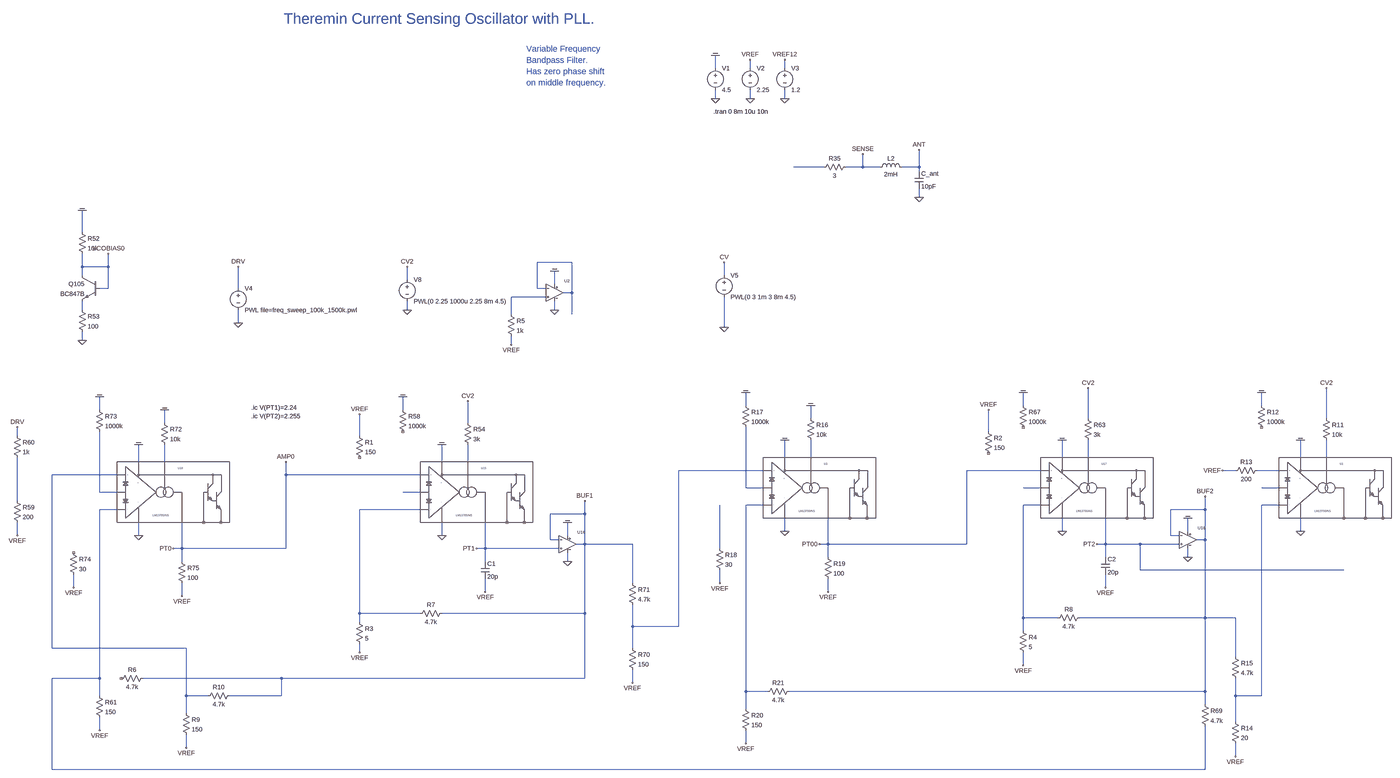
[diagram p0: schematic vco_and_lc_drive_v18.asc, whole sheet]
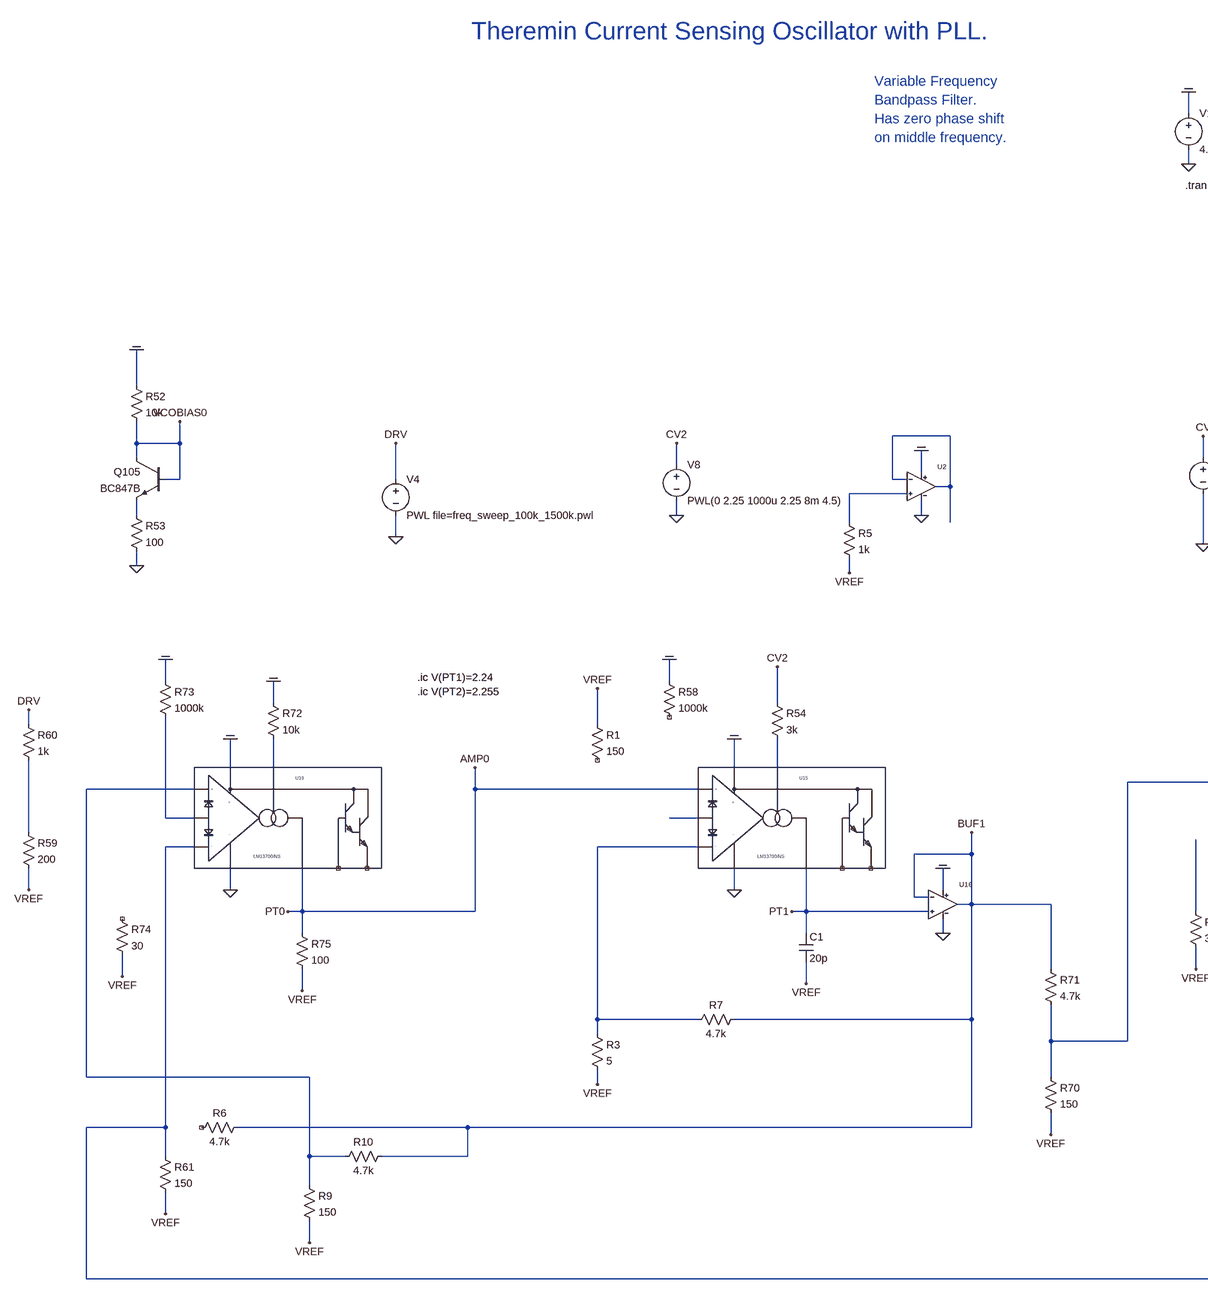
[diagram p1: schematic vco_and_lc_drive_v18.asc, part, row 1 of 1, column 1 of 2]
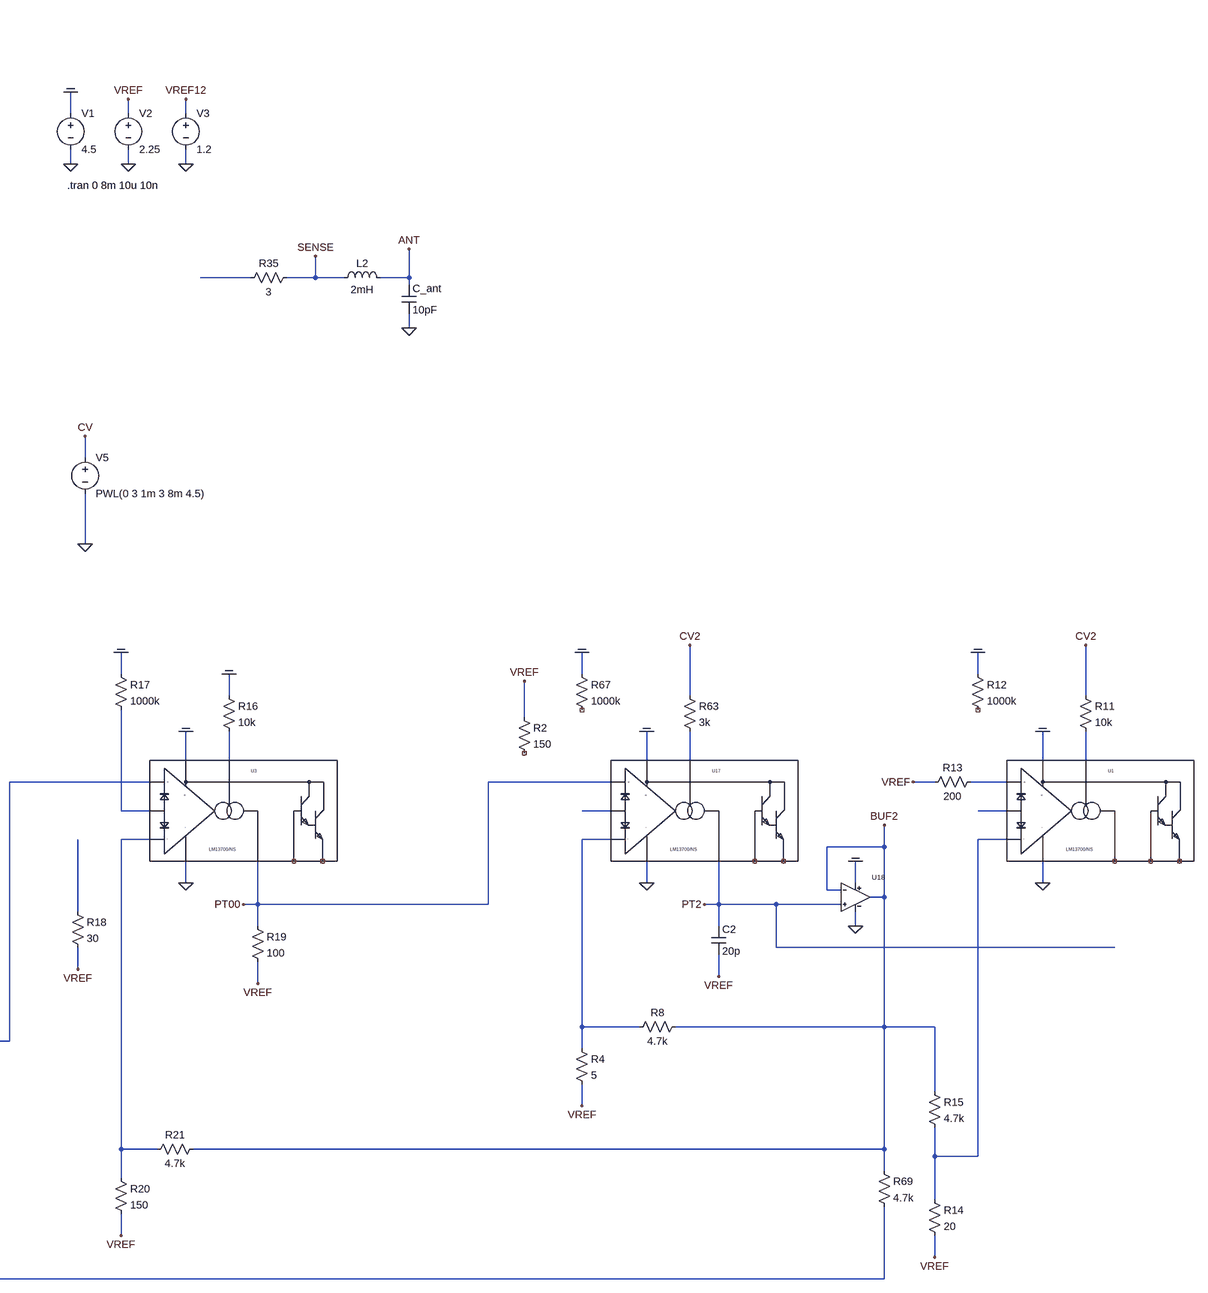
[diagram p2: schematic vco_and_lc_drive_v18.asc, part, row 1 of 1, column 2 of 2]
vco_and_lc_drive_v18.asc, the LTspice schematic file:
Version 4
SHEET 1 13504 29468
WIRE -5600 19072 -5600 19024
WIRE -5472 19072 -5472 19040
WIRE -5344 19072 -5344 19040
WIRE -5600 19184 -5600 19152
WIRE -5472 19184 -5472 19152
WIRE -5344 19184 -5344 19152
WIRE -5200 19440 -5312 19440
WIRE -5056 19440 -5056 19392
WIRE -5056 19440 -5120 19440
WIRE -4992 19440 -5056 19440
WIRE -4848 19440 -4848 19376
WIRE -4848 19440 -4912 19440
WIRE -4848 19456 -4848 19440
WIRE -4848 19552 -4848 19520
WIRE -8080 19680 -8080 19600
WIRE -6272 19792 -6400 19792
WIRE -8080 19808 -8080 19760
WIRE -7984 19808 -7984 19760
WIRE -7984 19808 -8080 19808
WIRE -8080 19840 -8080 19808
WIRE -5568 19840 -5568 19792
WIRE -6880 19856 -6880 19808
WIRE -6336 19872 -6336 19824
WIRE -7984 19888 -7984 19808
WIRE -7984 19888 -8016 19888
WIRE -7504 19888 -7504 19808
WIRE -6400 19888 -6400 19792
WIRE -6368 19888 -6400 19888
WIRE -6272 19904 -6272 19792
WIRE -6272 19904 -6304 19904
WIRE -6368 19920 -6496 19920
WIRE -8080 19968 -8080 19936
WIRE -6880 19968 -6880 19936
WIRE -6336 19968 -6336 19936
WIRE -6496 19984 -6496 19920
WIRE -6272 19984 -6272 19904
WIRE -7504 20016 -7504 19968
WIRE -5568 20032 -5568 19920
WIRE -8080 20080 -8080 20048
WIRE -6496 20096 -6496 20064
WIRE -5488 20624 -5488 20576
WIRE -4272 20624 -4272 20576
WIRE -3392 20624 -3392 20576
WIRE -8016 20640 -8016 20592
WIRE -6896 20640 -6896 20592
WIRE -5248 20672 -5248 20624
WIRE -4032 20672 -4032 20560
WIRE -3152 20672 -3152 20560
WIRE -7776 20688 -7776 20640
WIRE -6656 20688 -6656 20608
WIRE -4400 20720 -4400 20640
WIRE -8320 20736 -8320 20704
WIRE -7056 20736 -7056 20656
WIRE -5344 20816 -5344 20752
WIRE -5248 20816 -5248 20752
WIRE -4128 20816 -4128 20752
WIRE -4032 20816 -4032 20752
WIRE -3248 20816 -3248 20752
WIRE -3152 20816 -3152 20752
WIRE -7872 20832 -7872 20768
WIRE -7776 20832 -7776 20768
WIRE -6752 20832 -6752 20768
WIRE -6656 20832 -6656 20768
WIRE -5424 20864 -5824 20864
WIRE -4208 20864 -4480 20864
WIRE -3488 20864 -3536 20864
WIRE -3328 20864 -3408 20864
WIRE -7952 20880 -8192 20880
WIRE -7328 20880 -7328 20832
WIRE -6832 20880 -7328 20880
WIRE -5488 20928 -5488 20704
WIRE -5424 20928 -5488 20928
WIRE -4208 20928 -4272 20928
WIRE -3328 20928 -3392 20928
WIRE -8016 20944 -8016 20720
WIRE -7952 20944 -8016 20944
WIRE -6832 20944 -6896 20944
WIRE -8320 20976 -8320 20816
WIRE -5424 20992 -5488 20992
WIRE -4208 20992 -4272 20992
WIRE -3328 20992 -3392 20992
WIRE -7952 21008 -8016 21008
WIRE -6832 21008 -7056 21008
WIRE -3600 21008 -3600 20960
WIRE -3600 21008 -3728 21008
WIRE -6224 21024 -6224 20976
WIRE -6224 21024 -6352 21024
WIRE -5344 21088 -5344 21040
WIRE -4128 21088 -4128 21040
WIRE -3664 21088 -3664 21040
WIRE -3248 21088 -3248 21040
WIRE -8320 21104 -8320 21056
WIRE -7872 21104 -7872 21056
WIRE -6752 21104 -6752 21056
WIRE -6288 21104 -6288 21056
WIRE -3728 21104 -3728 21008
WIRE -3696 21104 -3728 21104
WIRE -6352 21120 -6352 21024
WIRE -6320 21120 -6352 21120
WIRE -3600 21120 -3600 21008
WIRE -3600 21120 -3632 21120
WIRE -6224 21136 -6224 21024
WIRE -6224 21136 -6256 21136
WIRE -6048 21136 -6224 21136
WIRE -5184 21136 -5184 21040
WIRE -5184 21136 -5216 21136
WIRE -4480 21136 -4480 20864
WIRE -4480 21136 -5184 21136
WIRE -3968 21136 -3968 21040
WIRE -3968 21136 -4000 21136
WIRE -3840 21136 -3968 21136
WIRE -3696 21136 -3840 21136
WIRE -7712 21152 -7712 21056
WIRE -7712 21152 -7744 21152
WIRE -7328 21152 -7328 20880
WIRE -7328 21152 -7712 21152
WIRE -6592 21152 -6592 21056
WIRE -6592 21152 -6624 21152
WIRE -6320 21152 -6592 21152
WIRE -5584 21152 -5584 20992
WIRE -5184 21184 -5184 21136
WIRE -3968 21184 -3968 21136
WIRE -3664 21184 -3664 21152
WIRE -7712 21200 -7712 21152
WIRE -6592 21200 -6592 21152
WIRE -6288 21200 -6288 21168
WIRE -3840 21232 -3840 21136
WIRE -3088 21232 -3840 21232
WIRE -6048 21280 -6048 21136
WIRE -5584 21280 -5584 21232
WIRE -8112 21296 -8112 21248
WIRE -3968 21296 -3968 21248
WIRE -6592 21312 -6592 21264
WIRE -5184 21312 -5184 21264
WIRE -7712 21328 -7712 21280
WIRE -7056 21392 -7056 21008
WIRE -6832 21392 -7056 21392
WIRE -6224 21392 -6224 21136
WIRE -6224 21392 -6752 21392
WIRE -4272 21408 -4272 20992
WIRE -4144 21408 -4272 21408
WIRE -3600 21408 -3600 21120
WIRE -3600 21408 -4064 21408
WIRE -3488 21408 -3600 21408
WIRE -7056 21424 -7056 21392
WIRE -6048 21440 -6048 21360
WIRE -5824 21440 -5824 20864
WIRE -5824 21440 -6048 21440
WIRE -4272 21456 -4272 21408
WIRE -8192 21520 -8192 20880
WIRE -7696 21520 -8192 21520
WIRE -6048 21520 -6048 21440
WIRE -7056 21536 -7056 21504
WIRE -3488 21552 -3488 21408
WIRE -4272 21584 -4272 21536
WIRE -8016 21632 -8016 21008
WIRE -8016 21632 -8192 21632
WIRE -7344 21632 -7856 21632
WIRE -6224 21632 -6224 21392
WIRE -6224 21632 -7344 21632
WIRE -6048 21648 -6048 21600
WIRE -5488 21680 -5488 20992
WIRE -5408 21680 -5488 21680
WIRE -3600 21680 -3600 21408
WIRE -3600 21680 -5328 21680
WIRE -8016 21696 -8016 21632
WIRE -7696 21696 -7696 21520
WIRE -7616 21696 -7696 21696
WIRE -7344 21696 -7344 21632
WIRE -7344 21696 -7536 21696
WIRE -3488 21696 -3488 21632
WIRE -3392 21696 -3392 20992
WIRE -3392 21696 -3488 21696
WIRE -3600 21728 -3600 21680
WIRE -5488 21744 -5488 21680
WIRE -7696 21760 -7696 21696
WIRE -3488 21792 -3488 21696
WIRE -8016 21824 -8016 21776
WIRE -5488 21872 -5488 21824
WIRE -7696 21888 -7696 21840
WIRE -3488 21920 -3488 21872
WIRE -8192 21968 -8192 21632
WIRE -3600 21968 -3600 21808
WIRE -3600 21968 -8192 21968
FLAG -5600 19184 0
FLAG -5600 19024 COM
FLAG -5472 19184 0
FLAG -5472 19040 VREF
FLAG -4848 19376 ANT
FLAG -5056 19392 SENSE
FLAG -5344 19184 0
FLAG -5344 19040 VREF12
FLAG -8080 19600 COM
FLAG -8080 20080 0
FLAG -7984 19760 VCOBIAS0
FLAG -4848 19552 0
FLAG -7504 20016 0
FLAG -7504 19808 DRV
FLAG -6336 19968 0
FLAG -5568 19792 CV
FLAG -5568 20032 0
FLAG -6880 19808 CV2
FLAG -6880 19968 0
FLAG -6336 19824 COM
FLAG -6496 20096 VREF
FLAG -6752 21104 0
FLAG -6752 20768 COM
FLAG -6624 21152 PT1
FLAG -6896 20592 COM
FLAG -6288 21200 0
FLAG -6288 21056 COM
FLAG -8320 20704 DRV
FLAG -8320 21104 VREF
FLAG -8016 21824 VREF
FLAG -4128 21088 0
FLAG -4128 20752 COM
FLAG -4000 21136 PT2
FLAG -4272 20576 COM
FLAG -3664 21184 0
FLAG -3664 21040 COM
FLAG -6048 21648 VREF
FLAG -7872 21104 0
FLAG -7872 20768 COM
FLAG -7744 21152 PT0
FLAG -7776 20640 COM
FLAG -8016 20592 COM
FLAG -8112 21296 VREF
FLAG -7712 21328 VREF
FLAG -7056 20656 VREF
FLAG -4400 20640 VREF
FLAG -6592 21312 VREF
FLAG -3968 21296 VREF
FLAG -7056 21536 VREF
FLAG -4272 21584 VREF
FLAG -7696 21888 VREF
FLAG -6656 20608 CV2
FLAG -4032 20560 CV2
FLAG -7328 20832 AMP0
FLAG -6224 20976 BUF1
FLAG -3600 20960 BUF2
FLAG -3248 21088 0
FLAG -3248 20752 COM
FLAG -3392 20576 COM
FLAG -3152 20560 CV2
FLAG -3536 20864 VREF
FLAG -3488 21920 VREF
FLAG -5344 21088 0
FLAG -5344 20752 COM
FLAG -5216 21136 PT00
FLAG -5248 20624 COM
FLAG -5488 20576 COM
FLAG -5584 21280 VREF
FLAG -5184 21312 VREF
FLAG -5488 21872 VREF
SYMBOL voltage -5600 19056 R0
SYMATTR InstName V1
SYMATTR Value 4.5
SYMBOL Voltage -5472 19056 R0
SYMATTR InstName V2
SYMATTR Value 2.25
SYMBOL ind -5008 19456 R270
WINDOW 0 32 56 VTop 2
WINDOW 3 5 56 VBottom 2
SYMATTR InstName L2
SYMATTR Value 2mH
SYMATTR SpiceLine Rser=120 Cpar=1pF
SYMBOL Cap -4864 19456 R0
SYMATTR InstName C_ant
SYMATTR Value 10pF
SYMBOL Res -5216 19456 R270
WINDOW 0 32 56 VTop 2
WINDOW 3 0 56 VBottom 2
SYMATTR InstName R35
SYMATTR Value 3
SYMBOL Voltage -5344 19056 R0
SYMATTR InstName V3
SYMATTR Value 1.2
SYMBOL npn -8016 19840 M0
SYMATTR InstName Q105
SYMATTR Value BC847B
SYMBOL Res -8096 19664 R0
SYMATTR InstName R52
SYMATTR Value 10k
SYMBOL Res -8096 19952 R0
SYMATTR InstName R53
SYMATTR Value 100
SYMBOL Voltage -7504 19872 R0
SYMATTR InstName V4
SYMATTR Value PWL file=freq_sweep_100k_1500k.pwl
SYMBOL MCP6021 -6336 19904 R0
SYMATTR InstName U2
SYMBOL Voltage -5568 19824 R0
SYMATTR InstName V5
SYMATTR Value PWL(0 3 1m 3 8m 4.5)
SYMBOL Voltage -6880 19840 R0
SYMATTR InstName V8
SYMATTR Value PWL(0 2.25 1000u 2.25 8m 4.5)
SYMBOL Res -6512 19968 R0
SYMATTR InstName R5
SYMATTR Value 1k
SYMBOL LM13700 -6752 20944 R0
SYMATTR InstName U15
SYMBOL Res -6672 20672 R0
SYMATTR InstName R54
SYMATTR Value 3k
SYMBOL Res -6912 20624 R0
SYMATTR InstName R58
SYMATTR Value 1000k
SYMBOL MCP6021 -6288 21136 R0
SYMATTR InstName U16
SYMBOL Res -8336 20960 R0
SYMATTR InstName R59
SYMATTR Value 200
SYMBOL Res -8336 20720 R0
SYMATTR InstName R60
SYMATTR Value 1k
SYMBOL Res -8032 21680 R0
SYMATTR InstName R61
SYMATTR Value 150
SYMBOL LM13700 -4128 20928 R0
SYMATTR InstName U17
SYMBOL Res -4048 20656 R0
SYMATTR InstName R63
SYMATTR Value 3k
SYMBOL Res -4288 20608 R0
SYMATTR InstName R67
SYMATTR Value 1000k
SYMBOL MCP6021 -3664 21120 R0
SYMATTR InstName U18
SYMBOL Res -3616 21712 R0
SYMATTR InstName R69
SYMATTR Value 4.7k
SYMBOL Res -6064 21504 R0
SYMATTR InstName R70
SYMATTR Value 150
SYMBOL Res -6064 21264 R0
SYMATTR InstName R71
SYMATTR Value 4.7k
SYMBOL LM13700 -7872 20944 R0
SYMATTR InstName U19
SYMBOL Res -7792 20672 R0
SYMATTR InstName R72
SYMATTR Value 10k
SYMBOL Res -8032 20624 R0
SYMATTR InstName R73
SYMATTR Value 1000k
SYMBOL Res -8128 21152 R0
SYMATTR InstName R74
SYMATTR Value 30
SYMBOL Res -7728 21184 R0
SYMATTR InstName R75
SYMATTR Value 100
SYMBOL Res -7072 20720 R0
SYMATTR InstName R1
SYMATTR Value 150
SYMBOL Res -4416 20704 R0
SYMATTR InstName R2
SYMATTR Value 150
SYMBOL Cap -6608 21200 R0
SYMATTR InstName C1
SYMATTR Value 20p
SYMBOL Cap -3984 21184 R0
SYMATTR InstName C2
SYMATTR Value 20p
SYMBOL Res -7072 21408 R0
SYMATTR InstName R3
SYMATTR Value 5
SYMBOL Res -4288 21440 R0
SYMATTR InstName R4
SYMATTR Value 5
SYMBOL Res -7840 21616 R90
WINDOW 0 0 56 VBottom 2
WINDOW 3 32 56 VTop 2
SYMATTR InstName R6
SYMATTR Value 4.7k
SYMBOL Res -6736 21376 R90
WINDOW 0 0 56 VBottom 2
WINDOW 3 32 56 VTop 2
SYMATTR InstName R7
SYMATTR Value 4.7k
SYMBOL Res -4048 21392 R90
WINDOW 0 0 56 VBottom 2
WINDOW 3 32 56 VTop 2
SYMATTR InstName R8
SYMATTR Value 4.7k
SYMBOL Res -7712 21744 R0
SYMATTR InstName R9
SYMATTR Value 150
SYMBOL Res -7520 21680 R90
WINDOW 0 0 56 VBottom 2
WINDOW 3 32 56 VTop 2
SYMATTR InstName R10
SYMATTR Value 4.7k
SYMBOL LM13700 -3248 20928 R0
SYMATTR InstName U1
SYMBOL Res -3168 20656 R0
SYMATTR InstName R11
SYMATTR Value 10k
SYMBOL Res -3408 20608 R0
SYMATTR InstName R12
SYMATTR Value 1000k
SYMBOL Res -3392 20848 R90
WINDOW 0 0 56 VBottom 2
WINDOW 3 32 56 VTop 2
SYMATTR InstName R13
SYMATTR Value 200
SYMBOL Res -3504 21776 R0
SYMATTR InstName R14
SYMATTR Value 20
SYMBOL Res -3504 21536 R0
SYMATTR InstName R15
SYMATTR Value 4.7k
SYMBOL LM13700 -5344 20928 R0
SYMATTR InstName U3
SYMBOL Res -5264 20656 R0
SYMATTR InstName R16
SYMATTR Value 10k
SYMBOL Res -5504 20608 R0
SYMATTR InstName R17
SYMATTR Value 1000k
SYMBOL Res -5600 21136 R0
SYMATTR InstName R18
SYMATTR Value 30
SYMBOL Res -5200 21168 R0
SYMATTR InstName R19
SYMATTR Value 100
SYMBOL Res -5504 21728 R0
SYMATTR InstName R20
SYMATTR Value 150
SYMBOL Res -5312 21664 R90
WINDOW 0 0 56 VBottom 2
WINDOW 3 32 56 VTop 2
SYMATTR InstName R21
SYMATTR Value 4.7k
TEXT -5608 19232 Left 2 !.tran 0 8m 10u 10n
TEXT -7336 18888 Left 5 ;Theremin Current Sensing Oscillator with PLL.
TEXT -6440 19000 Left 3 ;Variable Frequency \nBandpass Filter.\nHas zero phase shift \non middle frequency.
TEXT -7456 20632 Left 2 !.ic V(PT1)=2.24\n.ic V(PT2)=2.255

The netlist it stands for:
* vco_and_lc_drive_v18.asc
V1 COM 0 4.5
V2 VREF 0 2.25
L2 SENSE ANT 2mH Rser=120 Cpar=1pF
C_ant ANT 0 10pF
R35 N001 SENSE 3
V3 VREF12 0 1.2
Q105 VCOBIAS0 VCOBIAS0 N004 0 BC847B
R52 COM VCOBIAS0 10k
R53 N004 0 100
V4 DRV 0 PWL file=freq_sweep_100k_1500k.pwl
XU2 N003 N002 COM 0 N002 MCP6021  ; pins In+ In- V+ V- OUT
V5 CV 0 PWL(0 3 1m 3 8m 4.5)
V8 CV2 0 PWL(0 2.25 1000u 2.25 8m 4.5)
R5 N003 VREF 1k
XU15 N009 N017 AMP0 N023 PT1 0 NC_01 NC_02 COM LM13700/NS  ; pins Ibias Dio_bias in+ in- out V- buf_in buf_out V+
R54 CV2 N009 3k
R58 COM NC_03 1000k
XU16 PT1 BUF1 COM 0 BUF1 MCP6021  ; pins In+ In- V+ V- OUT
R59 N018 VREF 200
R60 DRV N018 1k
R61 N022 VREF 150
XU17 N006 N014 PT00 N020 PT2 0 NC_04 NC_05 COM LM13700/NS  ; pins Ibias Dio_bias in+ in- out V- buf_in buf_out V+
R63 CV2 N006 3k
R67 COM NC_06 1000k
XU18 PT2 BUF2 COM 0 BUF2 MCP6021  ; pins In+ In- V+ V- OUT
R69 BUF2 N022 4.7k
R70 N010 VREF 150
R71 BUF1 N010 4.7k
XU19 N008 N016 N012 N022 AMP0 0 NC_07 NC_08 COM LM13700/NS  ; pins Ibias Dio_bias in+ in- out V- buf_in buf_out V+
R72 COM N008 10k
R73 COM N016 1000k
R74 NC_09 VREF 30
R75 AMP0 VREF 100
R1 VREF NC_10 150
R2 VREF NC_11 150
C1 PT1 VREF 20p
C2 PT2 VREF 20p
R3 N023 VREF 5
R4 N020 VREF 5
R6 BUF1 NC_12 4.7k
R7 BUF1 N023 4.7k
R8 BUF2 N020 4.7k
R9 N012 VREF 150
R10 BUF1 N012 4.7k
XU1 N007 N015 N011 N021 NC_13 0 NC_14 NC_15 COM LM13700/NS  ; pins Ibias Dio_bias in+ in- out V- buf_in buf_out V+
R11 CV2 N007 10k
R12 COM NC_16 1000k
R13 N011 VREF 200
R14 N021 VREF 20
R15 BUF2 N021 4.7k
XU3 N005 N013 N010 N019 PT00 0 NC_17 NC_18 COM LM13700/NS  ; pins Ibias Dio_bias in+ in- out V- buf_in buf_out V+
R16 COM N005 10k
R17 COM N013 1000k
R18 N024 VREF 30
R19 PT00 VREF 100
R20 N019 VREF 150
R21 BUF2 N019 4.7k
.model NPN NPN
.model PNP PNP
.lib standard.bjt
.tran 0 8m 10u 10n
* Theremin Current Sensing Oscillator with PLL.
* Variable Frequency
* Bandpass Filter.
* Has zero phase shift
* on middle frequency.
.ic V(PT1)=2.24
.ic V(PT2)=2.255
.lib MCP6021.cir
.lib ns_models.lib
.backanno
.end